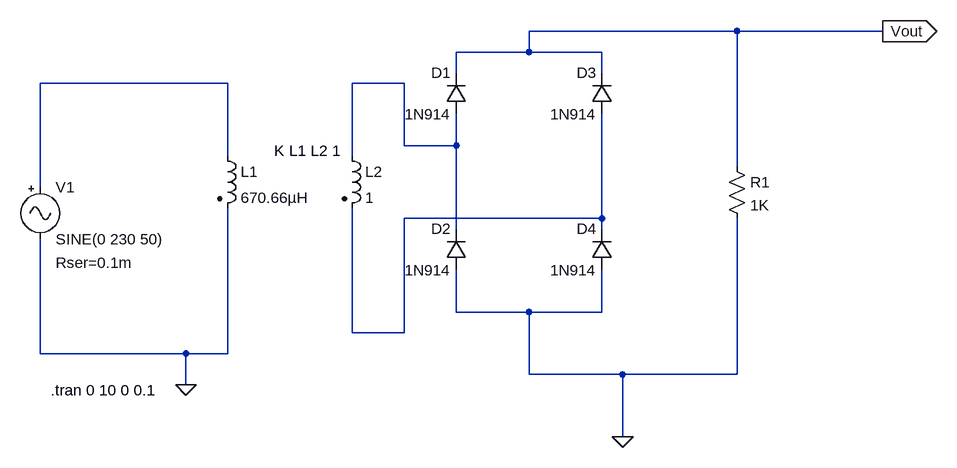
[diagram p0: schematic Ques1.asc]
Ques1.asc, the LTspice schematic file:
Version 4
SHEET 1 1024 680
WIRE 688 -128 368 -128
WIRE 912 -128 688 -128
WIRE 368 -96 368 -128
WIRE 368 -96 256 -96
WIRE 480 -96 368 -96
WIRE 256 -64 256 -96
WIRE 480 -64 480 -96
WIRE -96 -48 -384 -48
WIRE 176 -48 96 -48
WIRE 176 48 176 -48
WIRE 256 48 256 0
WIRE 256 48 176 48
WIRE -96 64 -96 -48
WIRE 96 64 96 -48
WIRE 688 80 688 -128
WIRE -384 112 -384 -48
WIRE 480 160 480 0
WIRE 480 160 176 160
WIRE 256 176 256 48
WIRE 480 176 480 160
WIRE 256 304 256 240
WIRE 368 304 256 304
WIRE 480 304 480 240
WIRE 480 304 368 304
WIRE 96 336 96 144
WIRE 176 336 176 160
WIRE 176 336 96 336
WIRE -384 368 -384 192
WIRE -160 368 -384 368
WIRE -96 368 -96 144
WIRE -96 368 -160 368
WIRE 368 400 368 304
WIRE 512 400 368 400
WIRE 688 400 688 160
WIRE 688 400 512 400
WIRE -160 416 -160 368
WIRE 512 496 512 400
FLAG 912 -128 Vout
IOPIN 912 -128 Out
FLAG 512 496 0
FLAG -160 416 0
SYMBOL ind2 -112 48 R0
SYMATTR InstName L1
SYMATTR Value 670.66µH
SYMATTR Type ind
SYMBOL ind2 80 48 R0
SYMATTR InstName L2
SYMATTR Value 1
SYMATTR Type ind
SYMBOL diode 496 0 R180
WINDOW 0 24 64 Left 2
WINDOW 3 24 0 Left 2
SYMATTR InstName D3
SYMATTR Value 1N914
SYMBOL res 672 64 R0
SYMATTR InstName R1
SYMATTR Value 1K
SYMATTR SpiceLine tol=1 pwr=0.1
SYMBOL Misc\\signal -384 96 R0
WINDOW 123 0 0 Left 0
WINDOW 39 24 132 Left 2
SYMATTR SpiceLine Rser=0.1m
SYMATTR InstName V1
SYMATTR Value SINE(0 230 50)
SYMBOL diode 272 240 R180
WINDOW 0 24 64 Left 2
WINDOW 3 24 0 Left 2
SYMATTR InstName D2
SYMATTR Value 1N914
SYMBOL diode 496 240 R180
WINDOW 0 24 64 Left 2
WINDOW 3 24 0 Left 2
SYMATTR InstName D4
SYMATTR Value 1N914
SYMBOL diode 272 0 R180
WINDOW 0 24 64 Left 2
WINDOW 3 24 0 Left 2
SYMATTR InstName D1
SYMATTR Value 1N914
TEXT -24 56 Left 2 !K L1 L2 1
TEXT -368 424 Left 2 !.tran 0 10 0 0.1

The netlist it stands for:
* Ques1.asc
L1 N001 0 670.66µH
L2 N002 N003 1
D3 N003 Vout 1N914
R1 Vout 0 1K tol=1 pwr=0.1
V1 N001 0 SINE(0 230 50) Rser=0.1m
D2 0 N002 1N914
D4 0 N003 1N914
D1 N002 Vout 1N914
.model D D
.lib standard.dio
K L1 L2 1
.tran 0 10 0 0.1
.backanno
.end